# EAGLE design Shield (EAGLE 6.6.0)
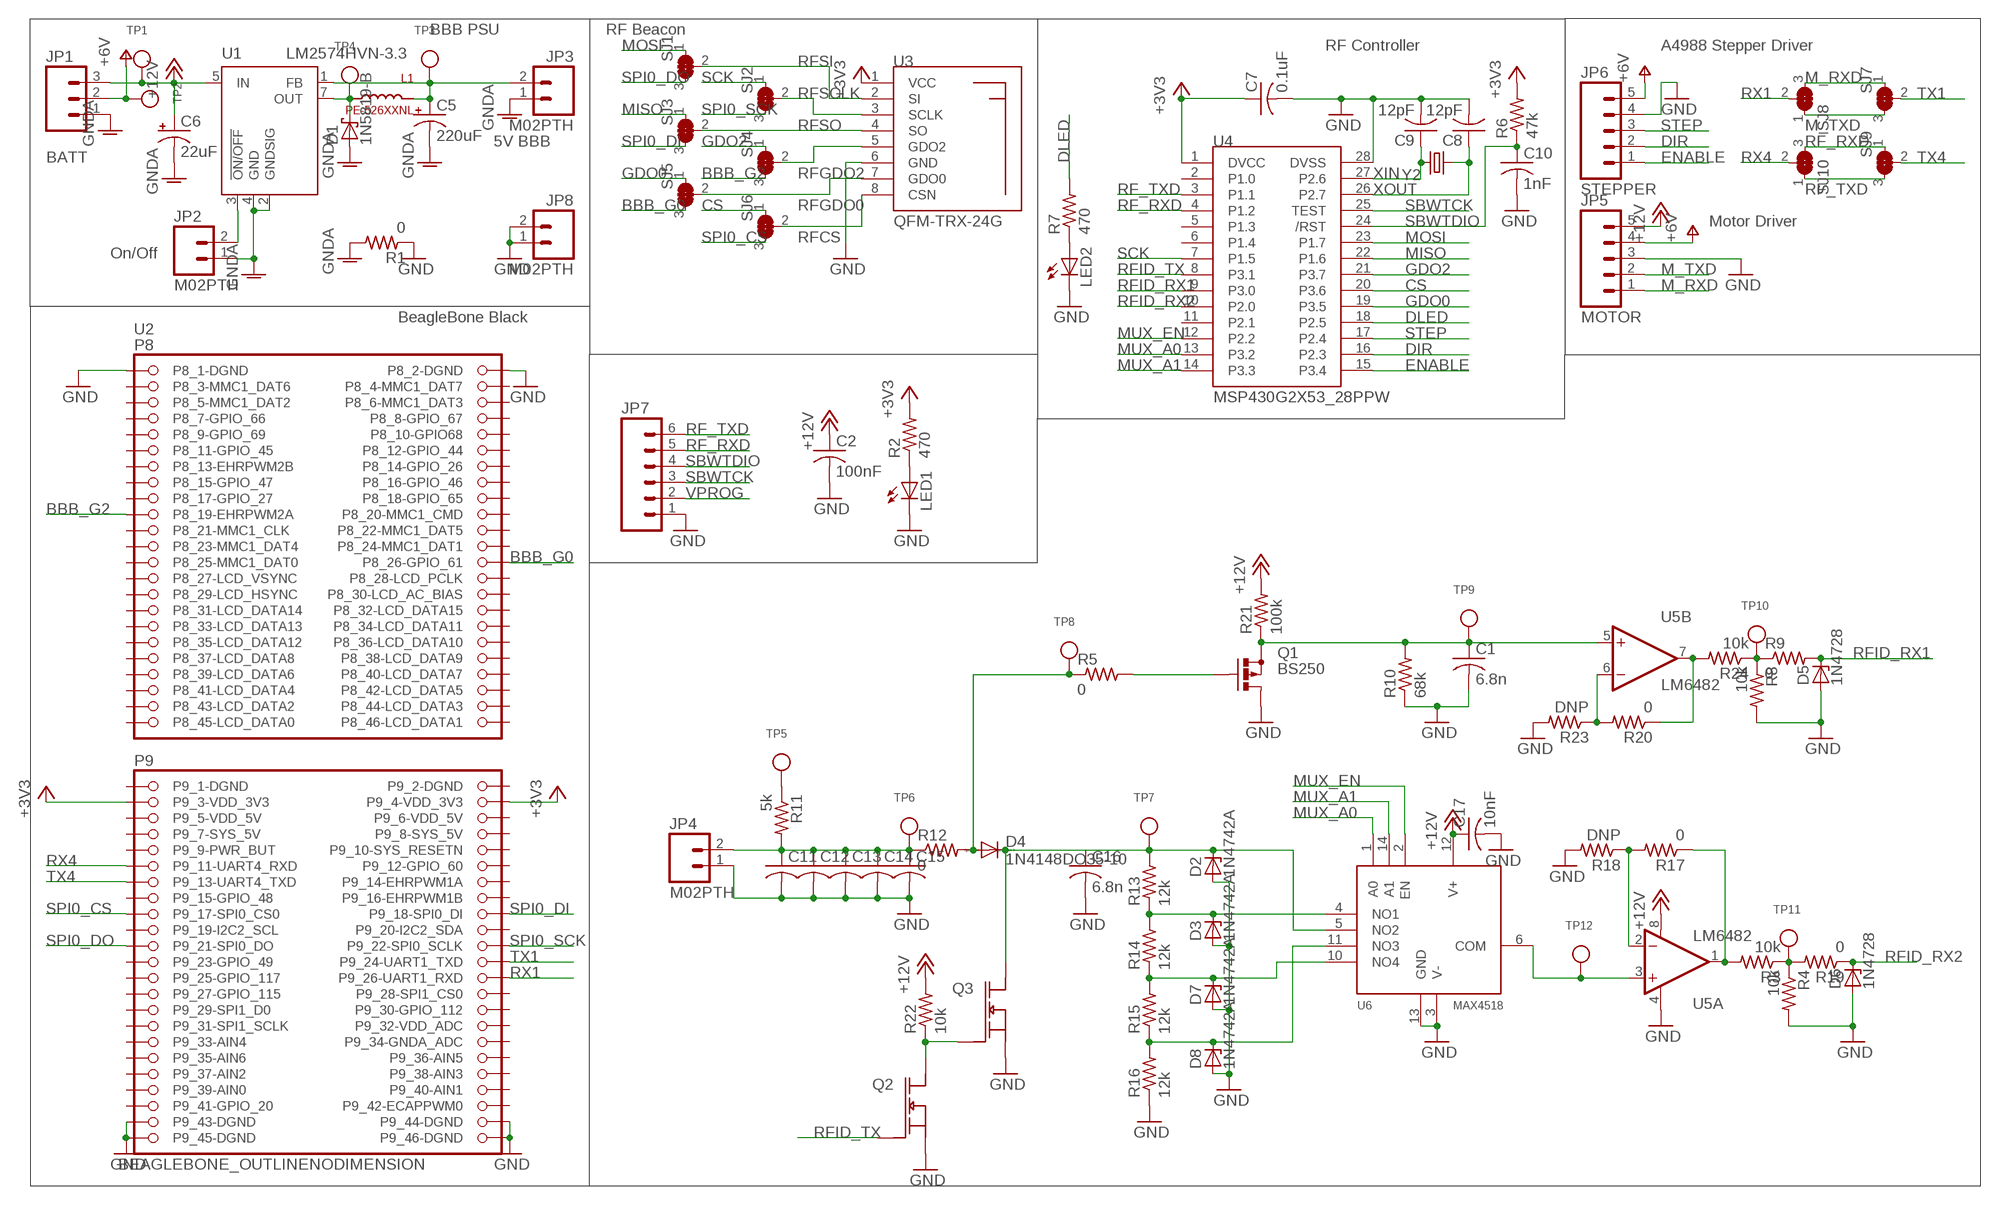
[diagram p0: schematic, sheet 1]

## Parts
C1  6.8n  C-USC0805  [C0805]
C2  100nF  C-USC0805  [C0805]
C5  220uF  CPOL-USE3.5-8  [E3,5-8]
C6  22uF  CPOL-USE2.5-5  [E2,5-5]
C7  0.1uF  C-USC0805  [C0805]
C8  12pF  C-USC0805  [C0805]
C9  12pF  C-USC0805  [C0805]
C10  1nF  C-USC0805  [C0805]
C11  C-USC0805  [C0805]
C12  C-USC0805  [C0805]
C13  C-USC0805  [C0805]
C14  C-USC0805  [C0805]
C15  C-USC0805  [C0805]
C16  6.8n  C-USC0805  [C0805]
C17  10nF  C-USC0805  [C0805]
D1  1N5819-B  [DO41-7.6]
D2  1N4742A  1N4728  [DO41Z10]
D3  1N4742A  1N4728  [DO41Z10]
D4  1N4148DO35-10  [DO35-10]
D5  1N4728  [DO41Z10]
D6  1N4728  [DO41Z10]
D7  1N4742A  1N4728  [DO41Z10]
D8  1N4742A  1N4728  [DO41Z10]
JP1  M03PTH  [1X03]
JP2  M02PTH  [1X02]
JP3  M02PTH  [1X02]
JP4  M02PTH  [1X02]
JP5  MOTOR  M05PTH  [1X05]
JP6  STEPPER  M05PTH  [1X05]
JP7  M06SIP  [1X06]
JP8  M02PTH  [1X02]
L1  PE-526XXNL  [PE_VERTICAL]
LED1  LEDCHIP-LED0805  [CHIP-LED0805]
LED2  LEDCHIP-LED0805  [CHIP-LED0805]
Q1  BS250  [SOT54E]
Q2  2N7002_SINGLESOT23/TO-236AB  [TO-236AB]
Q3  2N7002_SINGLESOT23/TO-236AB  [TO-236AB]
R1  0  R-US_R0805  [R0805]
R2  470  R-US_R0805  [R0805]
R3  10k  R-US_R0805  [R0805]
R4  10k  R-US_R0805  [R0805]
R5  0  R-US_R0805  [R0805]
R6  47k  R-US_R0805  [R0805]
R7  470  R-US_R0805  [R0805]
R8  10k  R-US_R0805  [R0805]
R9  0  R-US_R0805  [R0805]
R10  68k  R-US_R0805  [R0805]
R11  5k  R-US_R0805  [R0805]
R12  0  R-US_R0805  [R0805]
R13  12k  R-US_R0805  [R0805]
R14  12k  R-US_R0805  [R0805]
R15  12k  R-US_R0805  [R0805]
R16  12k  R-US_R0805  [R0805]
R17  0  R-US_R0805  [R0805]
R18  DNP  R-US_R0805  [R0805]
R19  0  R-US_R0805  [R0805]
R20  0  R-US_R0805  [R0805]
R21  100k  R-US_R0805  [R0805]
R22  10k  R-US_R0805  [R0805]
R23  DNP  R-US_R0805  [R0805]
R24  10k  R-US_R0805  [R0805]
SJ1  SOLDERJUMPER_2WAY0805  [SOLDERJUMPER_2WAY_OPEN_0805]
SJ2  SOLDERJUMPER_2WAY0805  [SOLDERJUMPER_2WAY_OPEN_0805]
SJ3  SOLDERJUMPER_2WAY0805  [SOLDERJUMPER_2WAY_OPEN_0805]
SJ4  SOLDERJUMPER_2WAY0805  [SOLDERJUMPER_2WAY_OPEN_0805]
SJ5  SOLDERJUMPER_2WAY0805  [SOLDERJUMPER_2WAY_OPEN_0805]
SJ6  SOLDERJUMPER_2WAY0805  [SOLDERJUMPER_2WAY_OPEN_0805]
SJ7  SOLDERJUMPER_2WAY0805  [SOLDERJUMPER_2WAY_OPEN_0805]
SJ8  SOLDERJUMPER_2WAY0805  [SOLDERJUMPER_2WAY_OPEN_0805]
SJ9  SOLDERJUMPER_2WAY0805  [SOLDERJUMPER_2WAY_OPEN_0805]
SJ10  SOLDERJUMPER_2WAY0805  [SOLDERJUMPER_2WAY_OPEN_0805]
TP1  TESTPOINT0.1"  [1X01_ROUND]
TP2  TESTPOINT0.1"  [1X01_ROUND]
TP3  TESTPOINT0.1"  [1X01_ROUND]
TP4  TESTPOINT0.1"  [1X01_ROUND]
TP5  TESTPOINT0.1"  [1X01_ROUND]
TP6  TESTPOINT0.1"  [1X01_ROUND]
TP7  TESTPOINT0.1"  [1X01_ROUND]
TP8  TESTPOINT0.1"  [1X01_ROUND]
TP9  TESTPOINT0.1"  [1X01_ROUND]
TP10  TESTPOINT0.1"  [1X01_ROUND]
TP11  TESTPOINT0.1"  [1X01_ROUND]
TP12  TESTPOINT0.1"  [1X01_ROUND]
U1  LM2574HVN-3.3  [DIL08]
U2  BEAGLEBONE_OUTLINENODIMENSION  [BEAGLEBONE_SHIELD_NODIMENSION]
U3  QFM-TRX-24G  [QFM-TRX1-24G]
U4  MSP430G2X53_28PPW  [PW(R-PDSO-G28)]
U5  LM6482  [SOIC8]
U6  MAX4518  [SO-14]
Y2  CRYSTALHC49UV  [HC49U-V]

## Nets
+3V3: C7.1 R2.2 R6.2 U2.9.3(P9_3-VDD_3V3) U2.9.4(P9_4-VDD_3V3) U3.1(VCC) U4.1(DVCC)
+12V: C2.1 C6.+ C17.1 JP1.3 JP5.5 R21.2 R22.2 TP1.1 U1.5(IN) U5.8(A:V+) U6.12(V+)
BBB_G0: SJ5.3 U2.8.26(P8_26-GPIO_61)
BBB_G2: SJ4.3 U2.8.19(P8_19-EHRPWM2A)
CS: SJ6.1 U4.20(P3.6)
DIR: JP6.2 U4.16(P2.3)
DLED: R7.2 U4.18(P2.5)
ENABLE: JP6.1 U4.15(P3.4)
GDO0: SJ5.1 U4.19(P3.5)
GDO2: SJ4.1 U4.21(P3.7)
GND: C1.2 C2.2 C7.2 C8.2 C9.2 C10.2 C11.2 C12.2 C13.2 C14.2 C15.2 C16.2 C17.2 D2.A D3.A D5.A D6.A D7.A D8.A JP4.1 JP5.3 JP6.4 JP7.1 JP8.1 JP8.2 LED1.C LED2.C Q1.D Q2.2(S) Q3.2(S) R1.1 R4.2 R8.2 R10.1 R16.1 R18.2 R23.2 U2.8.1(P8_1-DGND) U2.8.2(P8_2-DGND) U2.9.43(P9_43-DGND) U2.9.44(P9_44-DGND) U2.9.45(P9_45-DGND) U2.9.46(P9_46-DGND) U3.6(GND) U4.28(DVSS) U5.4(A:V-) U6.3(V-) U6.13(GND)
GNDA: C5.- C6.- D1.A JP1.1 JP2.1 JP3.1 R1.2 U1.2(GNDSIG) U1.4(GND)
M_RXD: JP5.1 SJ7.1 SJ8.3
M_TXD: JP5.2 SJ7.3 SJ8.1
MISO: SJ3.1 U4.22(P1.6)
MOSI: SJ1.1 U4.23(P1.7)
MUX_A0: U4.13(P3.2) U6.1(A0)
MUX_A1: U4.14(P3.3) U6.14(A1)
MUX_EN: U4.12(P2.2) U6.2(EN)
N$1: R11.1 TP5.1
N$2: LED2.A R7.1
N$3: D1.C L1.2 TP4.1 U1.7(OUT)
N$4: C5.+ JP3.2 L1.1 TP3.1 U1.1(FB)
N$6: JP2.2 U1.3(!ON/OFF)
N$8: TP12.1 U5.3(A:+IN) U6.6(COM)
N$9: C11.1 C12.1 C13.1 C14.1 C15.1 JP4.2 R11.2 R12.1 TP6.1
N$10: D4.A R5.1 R12.2 TP8.1
N$11: C16.1 D2.C D4.C Q3.3(D) R13.2 TP7.1 U6.5(NO2)
N$12: R20.2 R23.1 U5.6(B:-IN)
N$13: R20.1 R24.2 U5.7(B:OUT)
N$14: R17.2 R18.1 U5.2(A:-IN)
N$15: R8.1 R9.1 R24.1 TP10.1
N$16: R3.2 R17.1 U5.1(A:OUT)
N$17: R3.1 R4.1 R19.2 TP11.1
N$18: D3.C R13.1 R14.2 U6.4(NO1)
N$19: D7.C R14.1 R15.2 U6.10(NO4)
N$20: D8.C R15.1 R16.2 U6.11(NO3)
N$21: C1.1 Q1.S R10.2 R21.1 TP9.1 U5.5(B:+IN)
N$22: Q2.3(D) Q3.1(G) R22.1
N$23: Q1.G R5.2
N$27: LED1.A R2.1
RF_RXD: JP7.5 SJ9.1 SJ10.3 U4.4(P1.2)
RF_TXD: JP7.6 SJ9.3 SJ10.1 U4.3(P1.1)
RFCS: SJ6.2 U3.8(CSN)
RFGDO0: SJ5.2 U3.7(GDO0)
RFGDO2: SJ4.2 U3.5(GDO2)
RFID_RX1: D5.C R9.2 U4.9(P3.0)
RFID_RX2: D6.C R19.1 U4.10(P2.0)
RFID_TX: Q2.1(G) U4.8(P3.1)
RFSCLK: SJ2.2 U3.3(SCLK)
RFSI: SJ1.2 U3.2(SI)
RFSO: SJ3.2 U3.4(SO)
RX1: SJ8.2 U2.9.26(P9_26-UART1_RXD)
RX4: SJ10.2 U2.9.11(P9_11-UART4_RXD)
SBWTCK: JP7.3 U4.25(TEST)
SBWTDIO: C10.1 JP7.4 R6.1 U4.24(/RST)
SCK: SJ2.1 U4.7(P1.5)
SPI0_CS: SJ6.3 U2.9.17(P9_17-SPI0_CS0)
SPI0_DI: SJ3.3 U2.9.18(P9_18-SPI0_DI)
SPI0_DO: SJ1.3 U2.9.21(P9_21-SPI0_DO)
SPI0_SCK: SJ2.3 U2.9.22(P9_22-SPI0_SCLK)
STEP: JP6.3 U4.17(P2.4)
TX1: SJ7.2 U2.9.24(P9_24-UART1_TXD)
TX4: SJ9.2 U2.9.13(P9_13-UART4_TXD)
V+: JP1.2 JP5.4 JP6.5 TP2.1 ; supply symbol labelled +6V
VPROG: JP7.2
XIN: C9.1 U4.27(P2.6) Y2.2
XOUT: C8.1 U4.26(P2.7) Y2.1
Unconnected: U2.8.3(P8_3-MMC1_DAT6) U2.8.4(P8_4-MMC1_DAT7) U2.8.5(P8_5-MMC1_DAT2) U2.8.6(P8_6-MMC1_DAT3) U2.8.7(P8_7-GPIO_66) U2.8.8(P8_8-GPIO_67) U2.8.9(P8_9-GPIO_69) U2.8.10(P8_10-GPIO68) U2.8.11(P8_11-GPIO_45) U2.8.12(P8_12-GPIO_44) U2.8.13(P8_13-EHRPWM2B) U2.8.14(P8_14-GPIO_26) U2.8.15(P8_15-GPIO_47) U2.8.16(P8_16-GPIO_46) U2.8.17(P8_17-GPIO_27) U2.8.18(P8_18-GPIO_65) U2.8.20(P8_20-MMC1_CMD) U2.8.21(P8_21-MMC1_CLK) U2.8.22(P8_22-MMC1_DAT5) U2.8.23(P8_23-MMC1_DAT4) U2.8.24(P8_24-MMC1_DAT1) U2.8.25(P8_25-MMC1_DAT0) U2.8.27(P8_27-LCD_VSYNC) U2.8.28(P8_28-LCD_PCLK) U2.8.29(P8_29-LCD_HSYNC) U2.8.30(P8_30-LCD_AC_BIAS) U2.8.31(P8_31-LCD_DATA14) U2.8.32(P8_32-LCD_DATA15) U2.8.33(P8_33-LCD_DATA13) U2.8.34(P8_34-LCD_DATA11) U2.8.35(P8_35-LCD_DATA12) U2.8.36(P8_36-LCD_DATA10) U2.8.37(P8_37-LCD_DATA8) U2.8.38(P8_38-LCD_DATA9) U2.8.39(P8_39-LCD_DATA6) U2.8.40(P8_40-LCD_DATA7) U2.8.41(P8_41-LCD_DATA4) U2.8.42(P8_42-LCD_DATA5) U2.8.43(P8_43-LCD_DATA2) U2.8.44(P8_44-LCD_DATA3) U2.8.45(P8_45-LCD_DATA0) U2.8.46(P8_46-LCD_DATA1) U2.9.8(P9_8-SYS_5V) U2.9.9(P9_9-PWR_BUT) U2.9.10(P9_10-SYS_RESETN) U2.9.12(P9_12-GPIO_60) U2.9.14(P9_14-EHRPWM1A) U2.9.15(P9_15-GPIO_48) U2.9.16(P9_16-EHRPWM1B) U2.9.19(P9_19-I2C2_SCL) U2.9.20(P9_20-I2C2_SDA) U2.9.23(P9_23-GPIO_49) U2.9.25(P9_25-GPIO_117) U2.9.27(P9_27-GPIO_115) U2.9.28(P9_28-SPI1_CS0) U2.9.29(P9_29-SPI1_D0) U2.9.30(P9_30-GPIO_112) U2.9.31(P9_31-SPI1_SCLK) U2.9.32(P9_32-VDD_ADC) U2.9.33(P9_33-AIN4) U2.9.34(P9_34-GNDA_ADC) U2.9.35(P9_35-AIN6) U2.9.36(P9_36-AIN5) U2.9.37(P9_37-AIN2) U2.9.38(P9_38-AIN3) U2.9.40(P9_40-AIN1) U2.9.41(P9_41-GPIO_20) U2.9.42(P9_42-ECAPPWM0) U4.2(P1.0) U4.5(P1.3) U4.6(P1.4) U4.11(P2.1)

## Notes on the sheet
- BBB PSU | RF Beacon
- RF Controller | A4988 Stepper Driver
- 5V BBB
- BATT
- Motor Driver
- On/Off
- BeagleBone Black

## Power pins joined to a net without a drawn wire
P9_1-DGND: U2.9.1(P9_1-DGND)
P9_2-DGND: U2.9.2(P9_2-DGND)
P9_5-VDD_5V: U2.9.5(P9_5-VDD_5V)
P9_6-VDD_5V: U2.9.6(P9_6-VDD_5V)
P9_7-SYS_5V: U2.9.7(P9_7-SYS_5V)
P9_39-AIN0: U2.9.39(P9_39-AIN0)

## Library data of the parts
C1 C2 C7-C17 = rcl:C-US: CAPACITOR, American symbol
C5 C6 = rcl:CPOL-US: POLARIZED CAPACITOR, American symbol
D1 = diode:1N581*: 1.0A SCHOTTKY BARRIER RECTIFIER Source: http://www.diodes.com/datasheets/ds23001.pdf
D2 D3 D5-D8 = diode:1N4728: Z DIODE 3.3 V, 1W, 5 percent
D4 = diode:1N4148: DIODE high speed (Philips)
JP1 = SparkFun-Connectors:M03: Header 3 Standard 3-pin 0.1" header. Use with straight break away headers (SKU : PRT-00116), right angle break away headers (PRT-00553), swiss pins (PRT-00743), machine pins (PRT-00117), and female headers (PRT-00115). Molex polarized connector foot print use with SKU : PRT-08232 with associated crimp pins and housings.
JP2-JP4 JP8 = SparkFun-Connectors:M02: Standard 2-pin 0.1" header. Use with - straight break away headers ( PRT-00116) - right angle break away headers (PRT-00553) - swiss pins (PRT-00743) - machine pins (PRT-00117) - female headers (PRT-00115) Molex polarized connector foot print use with: PRT-08233 with associated crimp pins and housings. 2.54_SCREWTERM for use with PRT-10571. 3.5mm Screw Terminal footprints for PRT-08084 5mm Screw Terminal footprints for use with PRT-08433
JP5 JP6 = SparkFun-Connectors:M05: Header 5 Standard 5-pin 0.1" header. Use with straight break away headers (SKU : PRT-00116), right angle break away headers (PRT-00553), swiss pins (PRT-00743), machine pins (PRT-00117), and female headers (PRT-00115). Molex polarized connector foot print use with SKU : PRT-08230 with associated crimp pins and housings.
JP7 = SparkFun-Connectors:M06: Header 6 Standard 6-pin 0.1" header. Use with straight break away headers (SKU : PRT-00116), right angle break away headers (PRT-00553), swiss pins (PRT-00743), machine pins (PRT-00117), and female headers (PRT-00115). Molex polarized connector foot print use with SKU : PRT-08094 with associated crimp pins and housings. NOTES ON THE VARIANTS LOCK and LOCK_LONGPADS... This footprint was designed to help hold the alignment of a through-hole component (i.e. 6-pin header) while soldering it into place. You may notice that each hole has been shifted either up or down by 0.005 of an inch from it's more standard position (which is a perfectly straight line). This slight alteration caused the pins (the squares in the middle) to touch the edges of the holes. Because they are alternating, it causes a "brace" to hold the component in place. 0.005 has proven to be the perfect amount of "off-center" position when using our standard breakaway headers. Although looks a little odd when you look at the bare footprint, once you have a header in there, the alteration is very hard to notice. Also,if you push a header all the way into place, it is covered up entirely on the bottom side. This idea of altering the position of holes to aid alignment will be further integrated into the Sparkfun Library for other footprints. It can help hold any component with 3 or more connection pins.
L1 = npol:PE-526XXNL
LED1 LED2 = led:LED: LED OSRAM: - CHIPLED LG R971, LG N971, LY N971, LG Q971, LY Q971, LO R971, LY R971 LH N974, LH R974 LS Q976, LO Q976, LY Q976 LO Q996 - Hyper CHIPLED LW Q18S LB Q993, LB Q99A, LB R99A - SideLED LS A670, LO A670, LY A670, LG A670, LP A670 LB A673, LV A673, LT A673, LW A673 LH A674 LY A675 LS A676, LA A676, LO A676, LY A676, LW A676 LS A679, LY A679, LG A679 - Hyper Micro SIDELED® LS Y876, LA Y876, LO Y876, LY Y876 LT Y87S - SmartLED LW L88C, LW L88S LB L89C, LB L89S, LG L890 LS L89K, LO L89K, LY L89K LS L896, LA L896, LO L896, LY L896 - TOPLED LS T670, LO T670, LY T670, LG T670, LP T670 LSG T670, LSP T670, LSY T670, LOP T670, LYG T670 LG T671, LOG T671, LSG T671 LB T673, LV T673, LT T673, LW T673 LH T674 LS T676, LA T676, LO T676, LY T676, LB T676, LH T676, LSB T676, LW T676 LB T67C, LV T67C, LT T67C, LS T67K, LO T67K, LY T67K, LW E67C LS E67B, LA E67B, LO E67B, LY E67B, LB E67C, LV E67C, LT E67C LW T67C LS T679, LY T679, LG T679 LS T770, LO T770, LY T770, LG T770, LP T770 LB T773, LV T773, LT T773, LW T773 LH T774 LS E675, LA E675, LY E675, LS T675 LS T776, LA T776, LO T776, LY T776, LB T776 LHGB T686 LT T68C, LB T68C - Hyper Mini TOPLED® LB M676 - Mini TOPLED Santana® LG M470 LS M47K, LO M47K, LY M47K Source: http://www.osram.convergy.de LUXEON: - LUMILED® LXK2-PW12-R00, LXK2-PW12-S00, LXK2-PW14-U00, LXK2-PW14-V00 LXK2-PM12-R00, LXK2-PM12-S00, LXK2-PM14-U00 LXK2-PE12-Q00, LXK2-PE12-R00, LXK2-PE12-S00, LXK2-PE14-T00, LXK2-PE14-U00 LXK2-PB12-K00, LXK2-PB12-L00, LXK2-PB12-M00, LXK2-PB14-N00, LXK2-PB14-P00, LXK2-PB14-Q00 LXK2-PR12-L00, LXK2-PR12-M00, LXK2-PR14-Q00, LXK2-PR14-R00 LXK2-PD12-Q00, LXK2-PD12-R00, LXK2-PD12-S00 LXK2-PH12-R00, LXK2-PH12-S00 LXK2-PL12-P00, LXK2-PL12-Q00, LXK2-PL12-R00 Source: www.luxeon.com KINGBRIGHT: KA-3528ASYC Source: www.kingbright.com
Q1 = transistor-small-signal:BS250: P-CHANNEL MOS FET
Q2 Q3 = npol:2N7002_SINGLE
R1-R24 = rcl:R-US_: RESISTOR, American symbol
SJ1-SJ10 = microbuilder:SOLDERJUMPER_2WAY: 2-Way Solder Jumper
TP1-TP12 = microbuilder:TESTPOINT: Test Point Various test points for characterisation and PCB testing TESTPOINT_SMT - Compact Surface Mount Test Point [Digikey: 5016KTR-ND]; BOM: EXCLUDE
U1 = linear:LM2574?-*: SIMPLE SWITCHER 0.5A Step-Down Voltage Regulator Source: http://cache.national.com/ds/LM/LM2574.pdf
U2 = npol:BEAGLEBONE_OUTLINE: Should match A3 pinout - but not completely tested
U3 = npol:QFM-TRX-24G
U4 = npol:MSP430G2X53_28P
U5 = npol:LM6482
U6 = npol:MAX4518
Y2 = SparkFun-FreqCtrl:CRYSTAL: Various standard crystals. Proven footprints. Spark Fun Electronics SKU : COM-00534

## Board
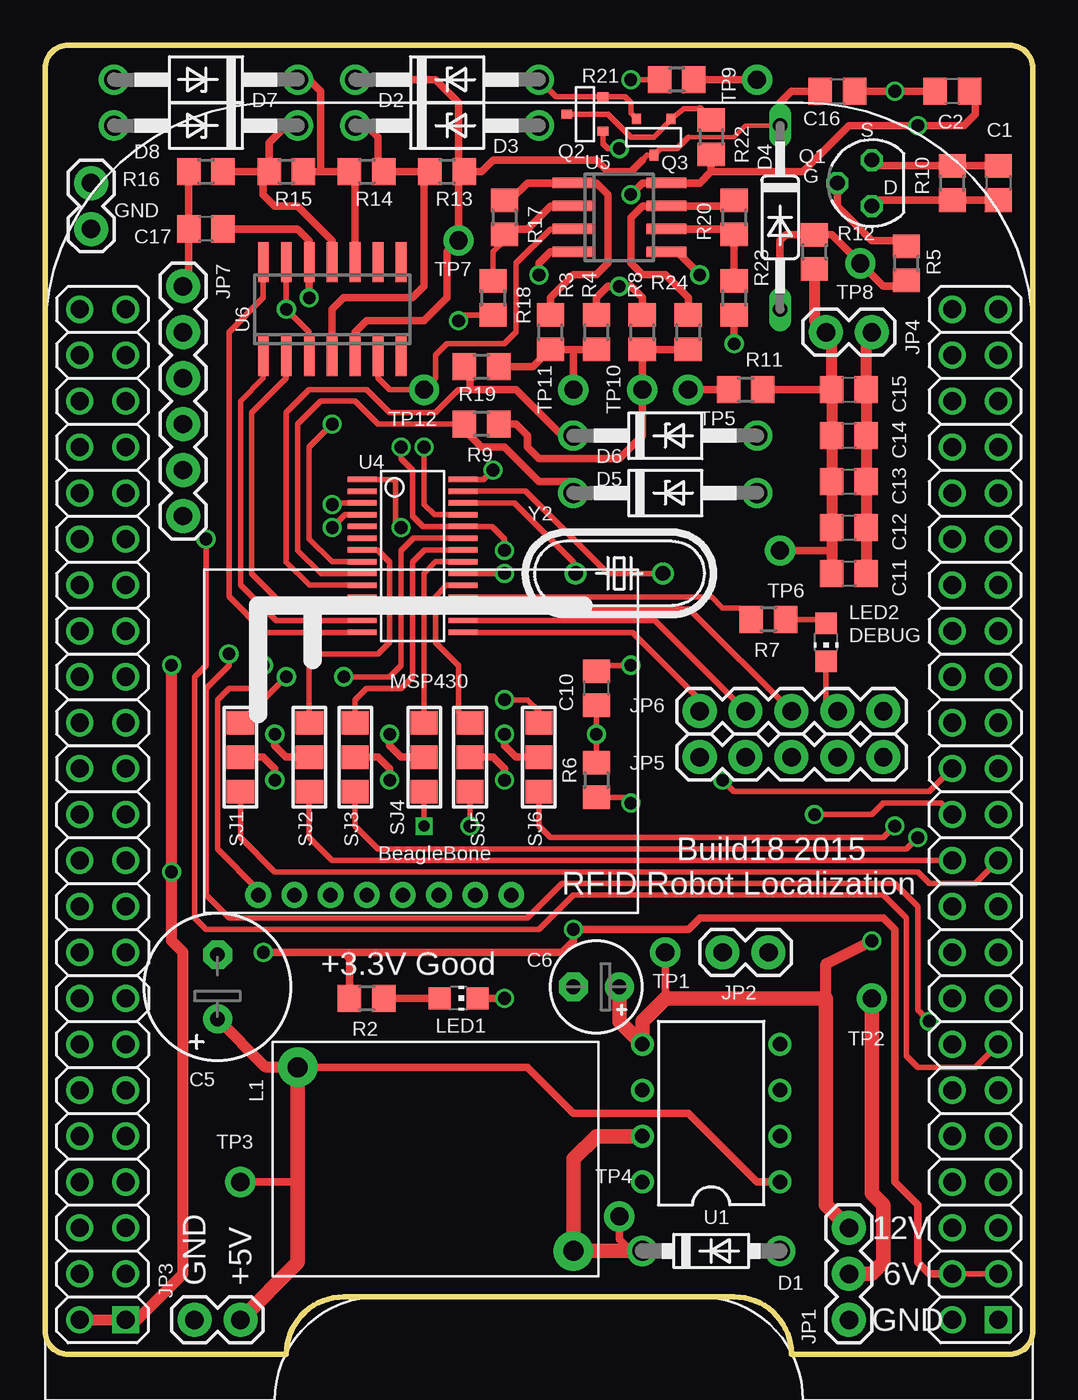
[diagram p1: board, top side]
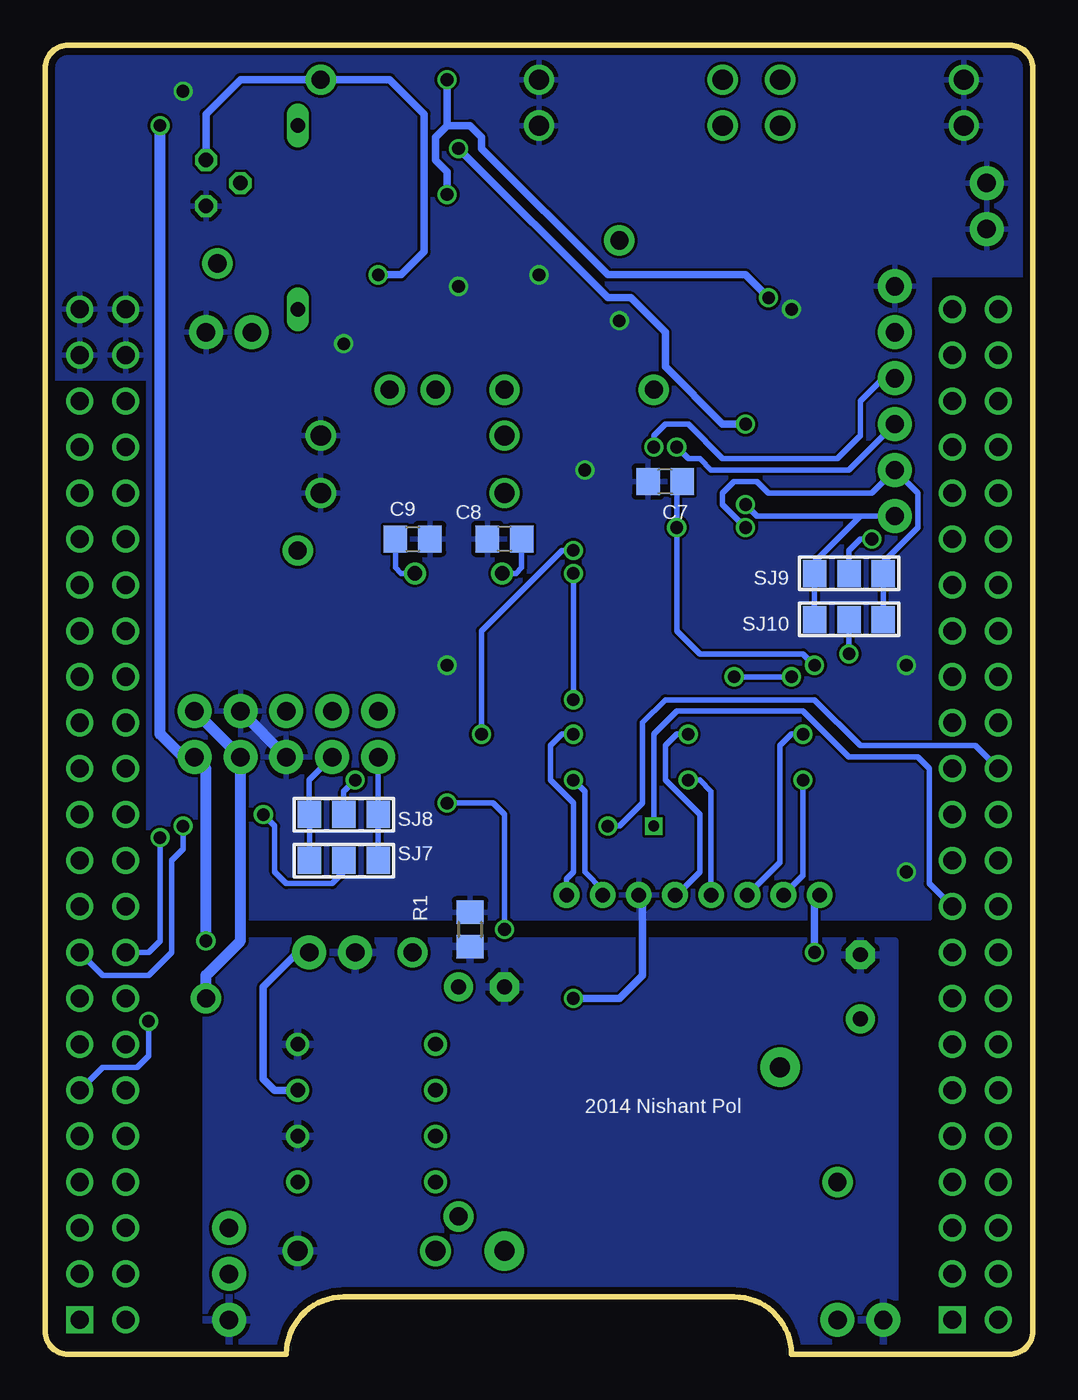
[diagram p2: board, bottom side, seen from below]

Size 54.61 x 72.39 mm. Coordinates in mm from the lower left corner, seen from the top.
Outline: 54.61,1.27 54.61,71.12 arc90 53.34,72.39 1.27,72.39 arc90 0,71.12 0,1.27 arc90 1.27,0 13.34,0 arc-90 16.51,3.17 38.1,3.17 arc-90 41.27,0 53.34,0 arc90 54.61,1.27
Copper layers (1*16): Top 0.0356mm / dielectric 1.5011mm / Bottom 0.0356mm
Design rules "OshPark": minimum track width 6mil, minimum drill 13mil, track to track 6mil, track to pad 6mil, pad to pad 6mil, via to via 6mil, smd to smd 6mil, copper to edge 15mil, drill to drill 6mil, minimum pad ring 7mil, minimum via ring 7mil, stop-mask expansion 4mil, vias tented up to drill 0mil, thermal gap 10mil

### Footprints (pad centres in the part's own frame; a part is rotated, then mirrored left to right if it is on the bottom)
C0805 = smd 1.3 x 1.5: 1 -0.95,0; 2 0.95,0
E3,5-8 = drill 0.813 pad 1.6: + -1.778,0 | drill 0.813 pad 1.6 octagon: - 1.778,0
E2,5-5 = drill 0.813 pad 1.6: + -1.27,0 | drill 0.813 pad 1.6 octagon: - 1.27,0
DO41-7.6 = drill 1.1 pad 1.7: A 3.81,0; C -3.81,0
DO41Z10 = drill 1.118: A 5.08,0; C -5.08,0
DO35-10 = drill 0.813 long: A 5.08,0; C -5.08,0
1X03 = drill 1.016 pad 1.88: 1 0,0; 2 2.54,0; 3 5.08,0
1X02 = drill 1.016 pad 1.88: 1 0,0; 2 2.54,0
1X05 = drill 1.016 pad 1.88: 1 0,0; 2 2.54,0; 3 5.08,0; 4 7.62,0; 5 10.16,0
1X06 = drill 1.016 pad 1.88: 1 0,0; 2 2.54,0; 3 5.08,0; 4 7.62,0; 5 10.16,0; 6 12.7,0
PE_VERTICAL = drill 1.1 pad 2.184: 1 5.08,7.62; 2 -5.08,-7.62
CHIP-LED0805 = smd 1.2 x 1.2: A 0,-1.05; C 0,1.05
SOT54E = drill 0.813 octagon: D -1.27,0; G 0,1.905; S 1.27,0
TO-236AB = smd 0.5 x 0.6: 1 0.95,1; 2 -0.95,1; 3 0,-1
R0805 = smd 1.3 x 1.5: 1 -0.95,0; 2 0.95,0
SOLDERJUMPER_2WAY_OPEN_0805 = smd 1.3 x 1.5: 1 -1.9,0; 2 0,0; 3 1.9,0
1X01_ROUND = drill 1 pad 1.676: 1 0,0
DIL08 = drill 0.813 pad 1.27: 1 -3.81,-3.81; 2 -1.27,-3.81; 3 1.27,-3.81; 4 3.81,-3.81; 5 3.81,3.81; 6 1.27,3.81; 7 -1.27,3.81; 8 -3.81,3.81
BEAGLEBONE_SHIELD_NODIMENSION = drill 1 square: 8.1 4.445,3.81; 9.1 52.705,3.81 | drill 1: 8.2 1.905,3.81; 8.3 4.445,6.35; 8.4 1.905,6.35; 8.5 4.445,8.89; 8.6 1.905,8.89; 8.7 4.445,11.43; 8.8 1.905,11.43; 8.9 4.445,13.97; 8.10 1.905,13.97; 8.11 4.445,16.51; 8.12 1.905,16.51; 8.13 4.445,19.05; 8.14 1.905,19.05; 8.15 4.445,21.59; 8.16 1.905,21.59; 8.17 4.445,24.13; 8.18 1.905,24.13; 8.19 4.445,26.67; 8.20 1.905,26.67; 8.21 4.445,29.21; 8.22 1.905,29.21; 8.23 4.445,31.75; 8.24 1.905,31.75; 8.25 4.445,34.29; 8.26 1.905,34.29; 8.27 4.445,36.83; 8.28 1.905,36.83; 8.29 4.445,39.37; 8.30 1.905,39.37; 8.31 4.445,41.91; 8.32 1.905,41.91; 8.33 4.445,44.45; 8.34 1.905,44.45; 8.35 4.445,46.99; 8.36 1.905,46.99; 8.37 4.445,49.53; 8.38 1.905,49.53; 8.39 4.445,52.07; 8.40 1.905,52.07; 8.41 4.445,54.61; 8.42 1.905,54.61; 8.43 4.445,57.15; 8.44 1.905,57.15; 8.45 4.445,59.69; 8.46 1.905,59.69; 9.2 50.165,3.81; 9.3 52.705,6.35; 9.4 50.165,6.35; 9.5 52.705,8.89; 9.6 50.165,8.89; 9.7 52.705,11.43; 9.8 50.165,11.43; 9.9 52.705,13.97; 9.10 50.165,13.97; 9.11 52.705,16.51; 9.12 50.165,16.51; 9.13 52.705,19.05; 9.14 50.165,19.05; 9.15 52.705,21.59; 9.16 50.165,21.59; 9.17 52.705,24.13; 9.18 50.165,24.13; 9.19 52.705,26.67; 9.20 50.165,26.67; 9.21 52.705,29.21; 9.22 50.165,29.21; 9.23 52.705,31.75; 9.24 50.165,31.75; 9.25 52.705,34.29; 9.26 50.165,34.29; 9.27 52.705,36.83; 9.28 50.165,36.83; 9.29 52.705,39.37; 9.30 50.165,39.37; 9.31 52.705,41.91; 9.32 50.165,41.91; 9.33 52.705,44.45; 9.34 50.165,44.45; 9.35 52.705,46.99; 9.36 50.165,46.99; 9.37 52.705,49.53; 9.38 50.165,49.53; 9.39 52.705,52.07; 9.40 50.165,52.07; 9.41 52.705,54.61; 9.42 50.165,54.61; 9.43 52.705,57.15; 9.44 50.165,57.15; 9.45 52.705,59.69; 9.46 50.165,59.69
QFM-TRX1-24G = drill 0.8 pad 1.422: 1 -6,0; 2 -4,0; 3 -2,0; 4 0,0; 5 2,0; 6 4,0; 7 6,0; 8 8,0
PW(R-PDSO-G28) = smd 0.3 x 1.6: 1 -3.925,-2.8; 2 -3.275,-2.8; 3 -2.625,-2.8; 4 -1.975,-2.8; 5 -1.325,-2.8; 6 -0.675,-2.8; 7 -0.025,-2.8; 8 0.625,-2.8; 9 1.275,-2.8; 10 1.925,-2.8; 11 2.575,-2.8; 12 3.225,-2.8; 13 3.875,-2.8; 14 4.525,-2.8; 15 4.525,2.8; 16 3.875,2.8; 17 3.225,2.8; 18 2.575,2.8; 19 1.925,2.8; 20 1.275,2.8; 21 0.625,2.8; 22 -0.025,2.8; 23 -0.675,2.8; 24 -1.325,2.8; 25 -1.975,2.8; 26 -2.625,2.8; 27 -3.275,2.8; 28 -3.925,2.8
SOIC8 = smd 0.6 x 2.2: 1 -1.905,-2.6; 2 -0.635,-2.6; 3 0.635,-2.6; 4 1.905,-2.6; 5 1.905,2.6; 6 0.635,2.6; 7 -0.635,2.6; 8 -1.905,2.6
SO-14 = smd 0.6 x 2.2: 1 -3.81,-2.6; 2 -2.54,-2.6; 3 -1.27,-2.6; 4 0,-2.6; 5 1.27,-2.6; 6 2.54,-2.6; 7 3.81,-2.6; 8 3.81,2.6; 9 2.54,2.6; 10 1.27,2.6; 11 0,2.6; 12 -1.27,2.6; 13 -2.54,2.6; 14 -3.81,2.6
HC49U-V = drill 0.813: 1 -2.413,0; 2 2.413,0

### Placement (x,y rotation side)
C1  52.7,64.77 270 top
C2  50.16,69.85 180 top
C5  9.53,20.32 90 top
C6  30.48,20.32 180 top
C7  20.32,48.26 180 bottom
C8  29.21,45.09 180 bottom
C9  34.29,45.09 0 bottom
C10  30.48,36.83 90 top
C11  44.45,43.18 0 top
C12  44.45,45.72 0 top
C13  44.45,48.26 0 top
C14  44.45,50.8 0 top
C15  44.45,53.34 0 top
C16  43.81,69.85 0 top
C17  8.89,62.23 180 top
D1  36.83,5.72 0 top
D2  22.23,70.48 0 top
D3  22.23,67.95 0 top
D4  40.64,62.87 270 top
D5  34.29,47.62 0 top
D6  34.29,50.8 0 top
D7  8.89,70.48 180 top
D8  8.89,67.95 180 top
JP1  44.45,1.91 90 top
JP2  37.47,22.22 0 top
JP3  8.26,1.91 0 top
JP4  45.72,56.52 180 top
JP5  36.2,33.02 0 top
JP6  36.2,35.56 0 top
JP7  7.62,59.05 270 top
JP8  2.54,62.23 90 top
L1  21.59,10.8 90 top
LED1  22.86,19.68 270 top
LED2  43.18,39.37 180 top
Q1  45.72,64.77 90 top
Q2  29.84,68.58 270 top
Q3  33.66,67.31 0 top
R1  31.11,23.5 270 bottom
R2  17.78,19.68 180 top
R3  27.94,56.52 90 top
R4  30.48,56.52 90 top
R5  47.62,60.33 90 top
R6  30.48,31.75 270 top
R7  40.01,40.64 180 top
R8  33.02,56.52 90 top
R9  24.13,51.44 180 top
R10  50.16,64.77 90 top
R11  38.73,53.34 0 top
R12  42.55,60.96 90 top
R13  22.23,65.41 0 top
R14  17.78,65.41 0 top
R15  13.34,65.41 0 top
R16  8.89,65.41 0 top
R17  25.4,62.87 270 top
R18  24.77,58.42 270 top
R19  24.13,54.61 0 top
R20  38.1,62.87 270 top
R21  34.92,70.48 180 top
R22  36.83,67.31 270 top
R23  38.1,58.42 270 top
R24  35.56,56.52 90 top
SJ1  10.79,33.02 270 top
SJ2  14.61,33.02 270 top
SJ3  17.14,33.02 270 top
SJ4  20.95,33.02 270 top
SJ5  23.5,33.02 270 top
SJ6  27.3,33.02 270 top
SJ7  38.1,27.3 180 bottom
SJ8  38.1,29.85 0 bottom
SJ9  10.16,43.18 180 bottom
SJ10  10.16,40.64 0 bottom
TP1  34.29,22.22 0 top
TP2  45.72,19.68 0 top
TP3  10.79,9.52 0 top
TP4  31.75,7.62 0 top
TP5  35.56,53.34 0 top
TP6  40.64,44.45 0 top
TP7  22.86,61.59 0 top
TP8  45.09,60.33 0 top
TP9  39.37,70.48 0 top
TP10  33.02,53.34 0 top
TP11  29.21,53.34 0 top
TP12  20.95,53.34 0 top
U1  36.83,13.34 90 top
U2  0,-1.9 0 top
U3  17.78,25.4 0 top
U4  20.32,44.45 270 top
U5  31.75,62.87 270 top
U6  15.88,57.79 0 top
Y2  31.75,43.18 0 top

### Tracks (layer width: path | path; a pad name or v marks a point on that pad's centre or on a via)
+3V3  (via drill 0.7)
  Top 0.305: U4.1 19.25,48.38 C7.1 19.37,46.04 v19.68,45.72 | R6.2 32.06,30.8 v32.38,30.48 | U3.1 11.78,25.68 9.53,27.94 9.53,36.2 10.16,36.83 11.43,36.83 12.06,37.47 v12.06,38.1 | U2.9.3 U2.9.4
  Top 0.406: 16.51,22.22 28.57,22.22 29.21,22.86 v29.21,23.5 35.56,23.5 36.2,24.13 46.35,24.13 46.99,23.5 46.99,9.52 48.26,8.25 48.26,5.08 48.9,4.45 U2.9.4 | 16.51,22.22 v12.06,22.22 | R2.2 16.83,21.9 16.51,22.22
  Bottom 0.305: C7.1 19.68,47.95 v19.68,45.72 19.68,40.01 18.41,38.73 12.7,38.73 v12.06,38.1 | v32.38,30.48 29.84,30.48 29.21,29.85 v29.21,23.5
  Bottom 0.406: v12.06,22.22 12.06,25.11 U3.1
+12V  (via drill 0.7)
  Top 0.305: v32.38,70.48 R21.2
  Top 0.406: TP1.1 34.29,19.68 | C17.1 13.97,62.23 14.61,61.59 U6.12 v14.61,58.42 | 36.83,65.41 36.2,64.77 U5.8 33.02,64.77 v32.38,64.14 | 36.83,65.41 R22.2 | 36.83,65.41 41.91,65.41 44.45,67.95 v48.26,67.95 50.8,67.95 51.44,68.58 51.44,69.53 C2.1
  Top 0.61: 43.18,19.68 43.18,21.59 v45.72,22.86
  Top 0.813: C6.+ 31.75,18.41 U1.5 33.02,18.41 34.29,19.68 43.18,19.68 43.18,8.25 JP1.3
  Bottom 0.406: v32.38,64.14 32.38,65.41 33.02,66.04 33.02,67.31 32.38,67.95 | 32.38,67.95 31.11,67.95 30.48,67.31 30.48,66.67 23.5,59.69 15.88,59.69 v14.61,58.42 | v32.38,70.48 32.38,67.95
  Bottom 0.61: v45.72,22.86 45.72,32.39 JP5.5 46.99,33.02 48.26,34.29 v48.26,67.95
BBB_G0  (via drill 0.7)
  Top 0.305: SJ5.3 v23.5,29.21
  Bottom 0.305: v23.5,29.21 22.86,29.21 21.59,30.48 21.59,34.93 20.32,36.2 12.06,36.2 9.53,33.66 3.17,33.66 U2.8.26
BBB_G2  (via drill 0.6)
  Top 0.305: SJ4.3 v20.95,29.21
  Bottom 0.305: v20.95,29.21 20.95,34.29 19.68,35.56 12.7,35.56 10.16,33.02 6.35,33.02 5.71,32.39 5.71,26.04 U2.8.19
CS  (via drill 0.7)
  Top 0.305: U4.20 24.77,43.18 v25.4,43.18 | v25.4,36.2 26.67,36.2 27.3,35.56 SJ6.1
  Bottom 0.305: v25.4,43.18 v25.4,36.2
DIR
  Top 0.305: U4.16 33.72,40.58 JP6.2
DLED
  Top 0.305: U4.18 36.87,41.88 37.47,41.28 38.42,41.28 R7.2
ENABLE
  Top 0.305: U4.15 32.47,39.93 36.2,36.2 JP6.1
GDO0
  Top 0.305: U4.19 22.2,42.53 21.59,41.91 21.59,39.37 22.86,38.1 22.86,35.55 SJ5.1
GDO2
  Top 0.305: U4.21 21.6,43.83 20.95,43.18 SJ4.1
GND  (via drill 0.7)
  Top 0.305: LED2.C 43.18,36.2 JP6.4 | U4.28 24.25,48.38 v24.77,48.9 | v32.38,38.1 30.8,38.1 C10.2 | U6.13 v13.34,57.79 14.61,56.52 U6.3 | R18.2 23.18,57.47 v22.86,57.15 | D2.A 28.26,69.53 Q2.2 32.07,69.53 32.38,69.22 32.38,68.63 Q3.2
  Top 0.406: R4.2 30.48,58.42 31.11,59.05 v31.75,59.05 32.38,59.05 33.02,58.42 R8.2 | U5.4 27.94,60.96 27.3,60.33 v27.3,59.69 | R23.2 v38.1,55.88 | JP7.1 7.94,59.38 C17.2 R16.1 | LED1.C v25.4,19.68 | C16.2 v46.99,69.85 C2.2 | C1.2 R10.1 46.04,63.82 Q1.D
  Top 0.61: C10.2 30.8,37.78 | U2.8.2 U2.8.1 5.08,1.91 7.62,4.45 7.62,22.22 6.99,22.86 v6.99,26.67 v6.99,38.1 | C11.2 C12.2 C13.2 C14.2 C15.2 45.4,56.2 JP4.1
  Bottom 0.406: v25.4,19.68 22.86,19.68 21.59,20.95 21.59,25.21 U3.6
  Bottom 0.61: JP6.4 JP5.3
  pour Bottom: 0,72.39 0,59.69 5.71,59.69 5.71,24.13 48.9,24.13 48.9,53.98 54.61,53.98 54.61,72.39
GNDA
  pour Bottom: 7.62,-3.17 45.72,-3.17 45.72,22.86 7.62,22.86
M_RXD
  Bottom 0.305: JP5.1 36.2,30.48 SJ8.3 SJ7.1
M_TXD
  Bottom 0.305: JP5.2 40.01,31.75 40.01,30.48 SJ8.1 SJ7.3
MISO
  Top 0.305: U4.22 20.98,44.48 20.32,43.82 20.32,37.47 19.68,36.83 17.78,36.83 17.14,36.2 SJ3.1
MOSI  (via drill 0.7)
  Top 0.305: U4.23 20.36,45.12 19.68,44.45 19.68,38.1 19.05,37.47 v16.51,37.47 | SJ1.1 v13.34,37.47
  Bottom 0.305: v13.34,37.47 v16.51,37.47
MUX_A0
  Top 0.305: U4.13 12.77,40.58 10.79,42.55 10.79,52.71 12.06,53.98 U6.1
MUX_A1
  Top 0.305: U4.14 12.14,39.93 10.16,41.91 10.16,56.52 12.06,58.42 U6.14
MUX_EN
  Top 0.305: U4.12 13.38,41.23 11.43,43.18 11.43,52.07 13.34,53.98 U6.2
N$1
  Top 0.406: TP5.1 R11.1
N$2
  Top 0.305: R7.1 43.4,40.64 LED2.A
N$3
  Top 0.406: TP4.1 31.75,6.35 32.38,5.72
  Top 0.813: D1.C 32.38,5.72 L1.2 29.21,10.8 30.48,12.07 U1.7
N$4
  Top 0.406: L1.1 26.67,15.88 29.21,13.34 35.56,13.34 39.37,9.52 U1.1 | TP3.1 13.97,9.52
  Top 0.61: L1.1 12.19,15.88 C5.+
  Top 0.813: L1.1 13.97,9.52 13.97,5.08 JP3.2
N$6
  Bottom 0.406: U1.3 41.91,14.61 42.55,15.24 42.55,20.32 40.64,22.22 JP2.2
N$8
  Top 0.305: U5.3 27.94,62.23 26.04,60.33 26.04,56.52 25.4,55.88 22.23,55.88 21.59,55.25 21.59,53.98 TP12.1 19.05,53.34 18.41,53.98 U6.6
N$9
  Top 0.406: R11.2 C15.1 | TP6.1 43.5,44.45
  Top 0.61: C11.1 43.5,44.45 C12.1 C13.1 C14.1 C15.1 43.5,56.2 JP4.2 42.55,57.15 R12.1
N$10
  Top 0.406: D4.A 40.64,61.59 40.95,61.91 R12.2 43.5,61.91 TP8.1 46.35,59.05 47.3,59.05 R5.1
N$11
  Top 0.254: 35.56,67.31 38.1,67.31 38.73,67.95 D4.C
  Top 0.305: 33.02,66.04 33.29,66.31 Q3.3 34.02,66.67 34.92,66.67 35.56,67.31
  Top 0.406: U6.5 17.14,56.52 17.78,57.15 20.95,57.15 22.23,58.42 22.23,60.96 TP7.1 22.86,65.09 R13.2 | R13.2 24.13,65.41 24.77,66.04 30.48,66.04 31.11,65.41 32.38,65.41 33.02,66.04 | D2.C 21.59,70.48 22.86,69.22 22.86,65.72 R13.2 | C16.1 41.27,69.85 40.64,69.22 D4.C
N$12
  Top 0.406: U5.6 37.78,62.23 R20.2 R23.1 38.1,59.05
N$13
  Top 0.406: R24.2 35.56,58.42 34.29,59.69 33.02,59.69 32.38,60.33 32.38,62.87 33.02,63.5 U5.7 37.78,63.5 R20.1
N$14
  Top 0.305: R17.2 25.4,61.59 24.77,60.96 R18.1
  Top 0.406: U5.2 27.94,63.5 26.67,62.23 25.71,62.23 R17.2
N$15
  Top 0.406: R24.1 R8.1 TP10.1 33.02,50.8 31.75,49.53 27.3,49.53 26.67,50.17 26.67,50.8 26.04,51.44 R9.1
N$16
  Top 0.406: R3.2 27.94,58.42 29.21,59.69 30.48,59.69 31.11,60.33 31.11,64.14 30.48,64.77 U5.1 26.67,64.77 25.71,63.81 R17.1
N$17
  Top 0.406: R4.1 29.21,55.57 | 29.21,55.57 R3.1 26.98,54.61 R19.2 | TP11.1 29.21,55.57
N$18
  Top 0.406: U6.4 15.88,57.79 16.51,58.42 20.32,58.42 20.95,59.05 20.95,65.09 R13.1 R14.2 18.41,65.72 18.41,67.31 17.78,67.95 D3.C
N$19
  Top 0.406: R15.2 15.24,65.41 | 15.24,65.41 R14.1 17.14,65.09 U6.10 | D7.C 14.61,70.48 15.24,69.85 15.24,65.41
N$20
  Top 0.406: R16.2 R15.1 | U6.11 15.88,61.59 13.97,63.5 12.7,63.5 12.06,64.14 12.06,65.09 R15.1 | R15.1 12.38,67 13.34,67.95 D8.C
N$21  (via drill 0.7)
  Top 0.406: C1.1 R10.2 46.04,65.72 Q1.S | U5.5 34.92,60.96 v36.2,59.69 | TP9.1 R21.1
  Bottom 0.406: v36.2,59.69 34.92,59.69 33.66,60.96 33.66,68.58 35.56,70.48 TP9.1 43.81,70.48 45.72,68.58 Q1.S
N$22
  Top 0.305: Q2.3 31.11,68.58 32.38,67.31 33.66,67.31 34.6,68.26 Q3.1 35.31,68.87 36.22,68.87
  Top 0.406: 36.22,68.87 R22.1
N$23
  Top 0.406: Q1.G 43.81,63.5 45.72,61.59 47.3,61.59 R5.2
N$27
  Top 0.406: R2.1 LED1.A
RF_RXD  (via drill 0.7)
  Top 0.305: U4.4 16.58,46.43 v15.88,45.72
  Bottom 0.305: SJ10.3 SJ9.1 8.26,43.81 6.35,45.72 6.35,47.62 JP7.5 8.89,47.62 14.61,47.62 15.24,48.26 16.51,48.26 17.14,47.62 17.14,46.99 v15.88,45.72
RF_TXD  (via drill 0.7)
  Top 0.305: U4.3 16.43,47.08 v15.88,46.99
  Bottom 0.305: SJ10.1 SJ9.3 12.06,43.82 9.53,46.36 JP7.6 15.24,46.36 v15.88,46.99
RFCS  (via drill 0.7)
  Top 0.406: SJ6.2 26.04,33.02 25.4,33.66 v25.4,34.29
  Bottom 0.305: U3.8 25.78,26.29 25.4,26.67 25.4,30.48 26.67,31.75 26.67,33.66 26.04,34.29 v25.4,34.29
RFGDO0  (via drill 0.7)
  Top 0.406: SJ5.2 24.77,33.02 25.4,32.39 v25.4,31.75
  Bottom 0.305: U3.7 23.78,25.68 24.77,26.67 24.77,31.11 v25.4,31.75
RFGDO2  (via drill 0.7)
  Top 0.406: v19.05,34.29 19.05,33.66 19.68,33.02 SJ4.2
  Bottom 0.305: U3.5 19.68,25.4 18.41,26.67 18.41,29.85 20.32,31.75 20.32,33.66 19.68,34.29 v19.05,34.29
RFID_RX1
  Top 0.305: U4.9 15.24,43.18 13.97,44.45 13.97,51.44 15.24,52.71 17.14,52.71 18.41,51.44 R9.2 22.86,51.76
  Top 0.406: R9.2 23.18,51.12 24.13,50.17 25.4,50.17 27.3,48.26 29.21,48.26 D5.C
RFID_RX2
  Top 0.305: U4.10 14.62,42.53 13.34,43.82 13.34,52.07 14.61,53.34 17.78,53.34 19.05,52.07 21.59,52.07 22.86,53.34 23.5,53.34 | 22.86,54.29 R19.1
  Top 0.406: R19.1 23.5,54.3 23.5,53.34 26.04,53.34 28.57,50.8 D6.C
RFID_TX  (via drill 0.7)
  Top 0.305: U4.8 15.87,43.83 14.61,45.09 14.61,50.17 v15.88,51.44 | Q2.1 30.84,66.95 31.11,66.67 v31.75,66.67
  Bottom 0.406: v15.88,51.44 17.14,51.44 20.32,54.61 20.32,56.52 22.23,58.42 23.5,58.42 v31.75,66.67
RFSCLK  (via drill 0.7)
  Top 0.406: SJ2.2 13.34,33.02 12.7,33.66 v12.7,34.29
  Bottom 0.305: v12.7,34.29 13.34,34.29 13.97,33.66 13.97,27.21 U3.3
  Bottom 0.406: U3.3 15.78,25.5
RFSI  (via drill 0.7)
  Top 0.406: SJ1.2 12.06,33.02 12.7,32.39 v12.7,31.75
  Bottom 0.305: v12.7,31.75 12.7,26.48 U3.2
RFSO  (via drill 0.7)
  Top 0.406: SJ3.2 18.41,33.02 19.05,32.39 v19.05,31.75
  Bottom 0.305: v19.05,31.75 18.41,31.75 17.78,31.11 U3.4
RX1  (via drill 0.7)
  Top 0.305: v37.47,31.75 38.1,31.11 48.9,31.11 U2.9.26
  Bottom 0.305: SJ8.2 38.1,31.11 v37.47,31.75
RX4  (via drill 0.7)
  Top 0.305: v10.16,38.73 10.16,38.1 8.89,36.83 8.89,25.4 10.16,24.13 26.67,24.13 28.57,26.04 46.99,26.04 48.26,24.77 48.26,19.05 v48.9,18.41
  Bottom 0.305: SJ10.2 v10.16,38.73 | v48.9,18.41 48.9,16.51 49.53,15.88 51.44,15.88 U2.9.11
SBWTCK  (via drill 0.7)
  Top 0.305: U4.25 21.52,46.43 20.95,46.99 v20.95,50.17
  Bottom 0.305: JP7.3 8.26,53.98 9.53,52.71 9.53,50.8 10.79,49.53 17.14,49.53 19.05,51.44 20.32,51.44 20.95,50.8 v20.95,50.17
SBWTDIO  (via drill 0.7)
  Top 0.305: v25.4,44.45 25.4,45.09 24.71,45.78 U4.24 20.9,45.78 20.32,46.36 20.32,48.9 19.68,49.53 v19.68,50.17 | C10.1 v30.48,34.29 R6.1
  Bottom 0.305: v25.4,44.45 26.04,44.45 30.48,40.01 v30.48,34.29 | JP7.4 10.16,48.9 17.78,48.9 18.41,49.53 19.05,49.53 v19.68,50.17
SCK
  Top 0.305: U4.7 18.39,44.48 19.05,43.82 19.05,39.37 18.41,38.73 15.24,38.73 14.61,38.1 SJ2.1
SPI0_CS  (via drill 0.7)
  Top 0.305: SJ6.3 27.3,29.21 27.94,28.57 46.35,28.57 v46.99,29.21
  Bottom 0.305: v46.99,29.21 46.99,27.94 47.62,27.3 47.62,22.22 48.9,20.95 51.44,20.95 U2.9.17
SPI0_DI  (via drill 0.7)
  Top 0.305: SJ3.3 17.14,29.21 18.41,27.94 47.62,27.94 v48.26,28.57
  Bottom 0.305: v48.26,28.57 48.26,22.86 48.9,22.22 U2.9.18
SPI0_DO
  Top 0.305: SJ1.3 10.79,28.57 12.7,26.67 48.26,26.67 48.9,26.04 51.44,26.04 U2.9.21
SPI0_SCK
  Top 0.305: SJ2.3 14.61,28.57 15.88,27.3 U2.9.22
STEP
  Top 0.305: U4.17 35.61,41.23 JP6.3
TX1  (via drill 0.7)
  Top 0.305: v42.55,29.85 45.72,29.85 46.35,30.48 49.53,30.48 U2.9.24
  Bottom 0.305: SJ7.2 38.1,26.67 38.73,26.04 41.27,26.04 41.91,26.67 41.91,29.21 v42.55,29.85
TX4  (via drill 0.7)
  Top 0.305: v8.89,45.09 8.89,38.1 8.26,37.47 8.26,24.13 8.89,23.5 27.3,23.5 29.21,25.4 46.35,25.4 47.62,24.13 47.62,16.51 48.26,15.88 51.44,15.88 U2.9.13
  Bottom 0.305: v8.89,45.09 9.53,45.09 10.16,44.45 SJ9.2
V+
  Top 0.813: JP1.2 45.72,4.45 46.35,5.08 46.35,8.25 45.72,8.89 TP2.1
  Bottom 0.61: JP6.5 JP5.4 43.81,22.86 45.72,20.95 TP2.1
XIN
  Top 0.305: U4.27 26.57,47.73 31.11,43.18 Y2.2
  Bottom 0.305: C9.1 35.24,43.5 34.92,43.18 Y2.2
XOUT
  Top 0.305: U4.26 25.95,47.08 29.21,43.82 29.21,43.31 Y2.1
  Bottom 0.305: C8.1 28.26,43.5 28.57,43.18 Y2.1

### Text on the board
tNames: S | G | D | GND | DEBUG | MSP430 | BeagleBone | Build18 2015 | RFID Robot Localization | +3.3V Good | 12V | GND | +5V | 6V | GND
bNames: 2014 Nishant Pol